# Altium schematic sheet amplifiers.SchDoc
size A; SheetNumber: 6; SheetTotal: 6
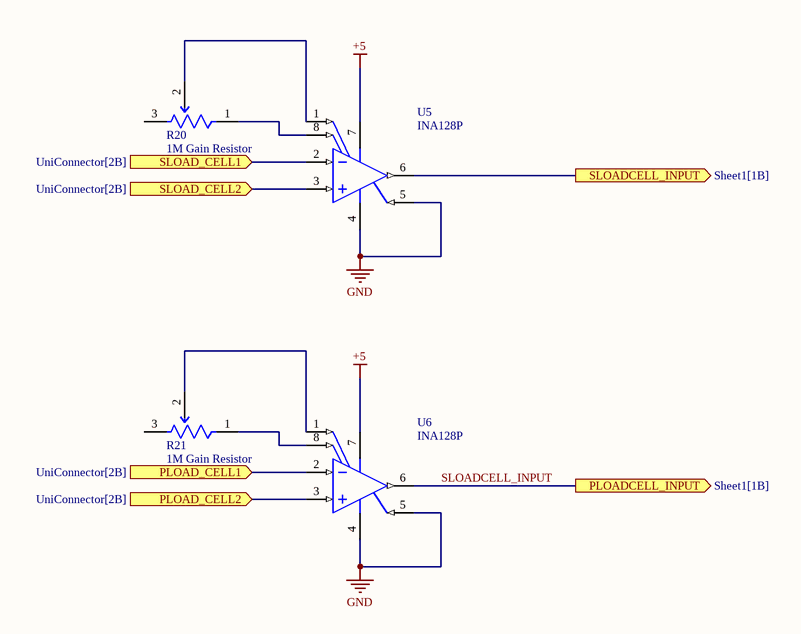
[diagram p0: amplifiers.SchDoc]

## Parts
R20  1M Gain Resistor  [FP-3296W-MFG]
R21  1M Gain Resistor  [FP-3296W-MFG]
U5  INA128P  [P0008A]
U6  INA128P  [P0008A]

## Ports
PLOAD_CELL1 (in, see UniConnector[2B]), PLOAD_CELL2 (in, see UniConnector[2B]), PLOADCELL_INPUT (out, see Sheet1[1B]), SLOAD_CELL1 (in, see UniConnector[2B]), SLOAD_CELL2 (in, see UniConnector[2B]), SLOADCELL_INPUT (out, see Sheet1[1B])

## Nets
+5: U5.7(V+) U6.7(V+)
GND: U5.4(V-) U5.5(REF) U6.4(V-) U6.5(REF)
PLOAD_CELL1: U6.2(VIN-) ; port PLOAD_CELL1
PLOAD_CELL2: U6.3(VIN+) ; port PLOAD_CELL2
SLOAD_CELL1: U5.2(VIN-) ; port SLOAD_CELL1
SLOAD_CELL2: U5.3(VIN+) ; port SLOAD_CELL2
SLOADCELL_INPUT: U5.6(VO) ; port SLOADCELL_INPUT
SLOADCELL_INPUT: U6.6(VO) ; port PLOADCELL_INPUT  [a separate net that carries the same name]
NetR20_1: R20.1(CCW) U5.8(RG)
NetR20_2: R20.2(WIPER) U5.1(RG)
NetR21_1: R21.1(CCW) U6.8(RG)
NetR21_2: R21.2(WIPER) U6.1(RG)

Not connected (* = marked no-connect by the designer): R20 3(CW); R21 3(CW)

## Library data of the parts
R20 R21 = CMP-07234-000048-1: TRIMMER 200K OHM 0.5W PC PIN TOP; Resistance Tolerance: 10%; Number of Turns: 25; Temperature Coefficient: 100ppm/°C; Power Rating: 500mW; Resistance: 200kR; Resistor Type: Cermet; Color: Blue; Radiation Hardening: No; RoHS Compliant: Yes; Taper: Linear; Technology: CERMET; Mount: Panel; Packaging: Rail/Tube; Lead Free: Lead Free; Tolerance: 10%; Min Operating Temperature: -55°C; Depth: 4.83mm; Length: 9.53mm; Width: 9.53mm; REACH SVHC: No SVHC; Package Quantity: 50; Height: 0.395inch; Max Power Dissipation: 500mW; Max Operating Temperature: 125°C; Military Standard: Not; Termination: Pin; Contact Plating: Tin; Series: 3296; Weight: 0.03oz
U5 U6 = CMP-0992-00131-2: Precision, Low Power Instrumentation Amplifier, -40 to 85 degC, 8-pin DIP (P8), Green (RoHS & no Sb/Br); Manufacturer: Texas Instruments; Gain(V/V): 1 to 10000; Noise at 1kHz(Typ)(nV/rt(Hz)): 8; Non-Linearity (+/-)(Max)(%): 0.002; Input Bias Current (+/-)(Max)(nA): 5; Input Offset (+/-)(Max)(uV): 50; Input Offset Drift (+/-)(Max)(uV/Degrees Celsius): 0.5; Vs(Max)(V): 36; CMRR(Min)(dB): 120; Vs(Min)(V): 4.5; SubFamily: Dual Supply; Quiescent Current (+/-)(Typ)(mA): 0.7; Number of Channels: 1; DatasheetVersion: SBOS051B; ComponentLink1URL: http://www.ti.com/; PackageReference: P0008A; ComponentLink2Description: Datasheet; PartNumber: INA128P; ComponentLink1Description: Manufacturer URL; PackageDescription: 8-Pin Plastic In-Line, Body 9.59 x 6.35 mm, Pitch 2.54 mm; Code_JEDEC: MS-001; PackageVersion: 4040082/E, 04/2010; ComponentLink3Description: Package Specification; ComponentLink2URL: http://www.ti.com/general/docs/lit/getliterature.tsp?genericPartNumber=INA128&fileType=pdf; Eco-Plan: Green (RoHS & no Sb/Br); Mounting Technology: Through Hole; ComponentLink3URL: http://www.ti.com/litv/pdf/mpdi001b